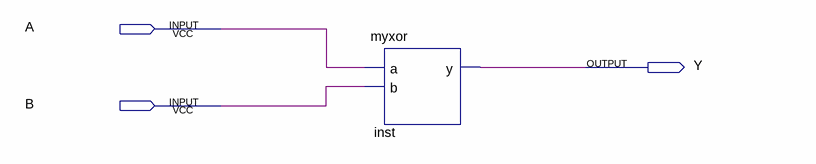
[diagram p0: schematic sheet]
// Quartus schematic demo1.bdf as structural Verilog: 1 symbols, 3 pins
module demo1 (
  input  A,
  input  B,
  output Y
);

  myxor inst (.a(A), .b(B), .y(Y));
endmodule
